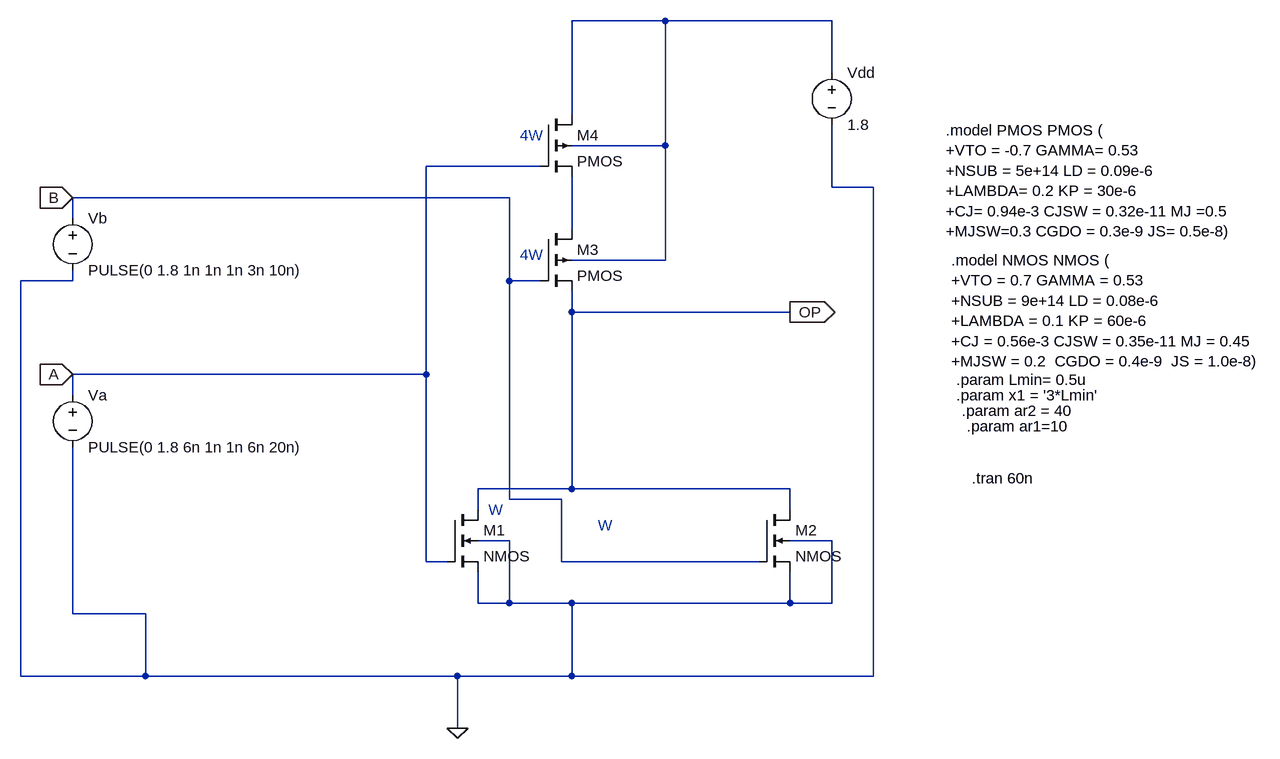
[diagram p0: schematic NOR.asc]
NOR.asc, the LTspice schematic file:
Version 4
SHEET 1 1364 680
WIRE 416 -464 272 -464
WIRE 672 -464 416 -464
WIRE 672 -384 672 -464
WIRE 272 -320 272 -464
WIRE 416 -272 416 -464
WIRE 416 -272 272 -272
WIRE 224 -240 48 -240
WIRE 672 -208 672 -304
WIRE 736 -208 672 -208
WIRE 176 -192 -496 -192
WIRE -496 -160 -496 -192
WIRE 272 -144 272 -224
WIRE 416 -96 416 -272
WIRE 416 -96 272 -96
WIRE -496 -64 -496 -80
WIRE -496 -64 -576 -64
WIRE 176 -64 176 -192
WIRE 224 -64 176 -64
WIRE 272 -16 272 -48
WIRE 608 -16 272 -16
WIRE 48 80 48 -240
WIRE 48 80 -496 80
WIRE -496 112 -496 80
WIRE 272 256 272 -16
WIRE 272 256 128 256
WIRE 608 256 272 256
WIRE 176 272 176 -64
WIRE 256 272 176 272
WIRE 128 288 128 256
WIRE 608 288 608 256
WIRE 176 336 128 336
WIRE 672 336 608 336
WIRE 48 368 48 80
WIRE 80 368 48 368
WIRE 256 368 256 272
WIRE 560 368 256 368
WIRE 128 432 128 384
WIRE 176 432 176 336
WIRE 176 432 128 432
WIRE 272 432 176 432
WIRE 608 432 608 384
WIRE 608 432 272 432
WIRE 672 432 672 336
WIRE 672 432 608 432
WIRE -496 448 -496 192
WIRE -384 448 -496 448
WIRE -576 544 -576 -64
WIRE -384 544 -384 448
WIRE -384 544 -576 544
WIRE 96 544 -384 544
WIRE 272 544 272 432
WIRE 272 544 96 544
WIRE 736 544 736 -208
WIRE 736 544 272 544
WIRE 96 624 96 544
FLAG 608 -16 OP
IOPIN 608 -16 Out
FLAG -496 -192 B
IOPIN -496 -192 In
FLAG -496 80 A
IOPIN -496 80 In
FLAG 96 624 0
SYMBOL nmos4 80 288 R0
SYMATTR InstName M1
SYMATTR Value2 l={Lmin} w={AR1*Lmin} ad={x1*AR1*Lmin} as={x1*AR1*Lmin} pd={2*x1 + 2*AR1*Lmin} ps={2*x1 + 2*AR1*Lmin}
SYMBOL nmos4 560 288 R0
SYMATTR InstName M2
SYMATTR Value2 l={Lmin} w={AR1*Lmin} ad={x1*AR1*Lmin} as={x1*AR1*Lmin} pd={2*x1 + 2*AR1*Lmin} ps={2*x1 + 2*AR1*Lmin}
SYMBOL pmos4 224 -144 R0
SYMATTR InstName M3
SYMATTR Value2 l={Lmin} w={AR2*Lmin} ad={x1*AR2*Lmin} as={x1*AR2*Lmin} pd={2*x1 + 2*AR2*Lmin} ps={2*x1 + 2*AR2*Lmin}
SYMBOL pmos4 224 -320 R0
SYMATTR InstName M4
SYMATTR Value2 l={Lmin} w={AR2*Lmin} ad={x1*AR2*Lmin} as={x1*AR2*Lmin} pd={2*x1 + 2*AR2*Lmin} ps={2*x1 + 2*AR2*Lmin}
SYMBOL voltage 672 -400 R0
SYMATTR InstName Vdd
SYMATTR Value 1.8
SYMBOL voltage -496 96 R0
WINDOW 123 0 0 Left 0
WINDOW 39 0 0 Left 0
SYMATTR InstName Va
SYMATTR Value PULSE(0 1.8 6n 1n 1n 6n 20n)
SYMBOL voltage -496 -176 R0
WINDOW 123 0 0 Left 0
WINDOW 39 0 0 Left 0
SYMATTR InstName Vb
SYMATTR Value PULSE(0 1.8 1n 1n 1n 3n 10n)
TEXT 848 -296 Left 2 !.model PMOS PMOS (\n+VTO = -0.7 GAMMA= 0.53 \n+NSUB = 5e+14 LD = 0.09e-6 \n+LAMBDA= 0.2 KP = 30e-6\n+CJ= 0.94e-3 CJSW = 0.32e-11 MJ =0.5 \n+MJSW=0.3 CGDO = 0.3e-9 JS= 0.5e-8)
TEXT 856 -96 Left 2 !.model NMOS NMOS ( \n+VTO = 0.7 GAMMA = 0.53 \n+NSUB = 9e+14 LD = 0.08e-6 \n+LAMBDA = 0.1 KP = 60e-6 \n+CJ = 0.56e-3 CJSW = 0.35e-11 MJ = 0.45 \n+MJSW = 0.2  CGDO = 0.4e-9  JS = 1.0e-8)
TEXT 864 88 Left 2 !.param Lmin= 0.5u
TEXT 864 112 Left 2 !.param x1 = '3*Lmin'
TEXT 872 136 Left 2 !.param ar2 = 40
TEXT 880 160 Left 2 !.param ar1=10
TEXT 888 240 Left 2 !.tran 60n
TEXT 144 288 Left 2 ;W
TEXT 312 312 Left 2 ;W
TEXT 192 -288 Left 2 ;4W
TEXT 192 -104 Left 2 ;4W

The netlist it stands for:
* NOR.asc
M1 OP A 0 0 NMOS l={Lmin} w={AR1*Lmin} ad={x1*AR1*Lmin} as={x1*AR1*Lmin} pd={2*x1 + 2*AR1*Lmin} ps={2*x1 + 2*AR1*Lmin}
M2 OP B 0 0 NMOS l={Lmin} w={AR1*Lmin} ad={x1*AR1*Lmin} as={x1*AR1*Lmin} pd={2*x1 + 2*AR1*Lmin} ps={2*x1 + 2*AR1*Lmin}
M3 N002 B OP N001 PMOS l={Lmin} w={AR2*Lmin} ad={x1*AR2*Lmin} as={x1*AR2*Lmin} pd={2*x1 + 2*AR2*Lmin} ps={2*x1 + 2*AR2*Lmin}
M4 N001 A N002 N001 PMOS l={Lmin} w={AR2*Lmin} ad={x1*AR2*Lmin} as={x1*AR2*Lmin} pd={2*x1 + 2*AR2*Lmin} ps={2*x1 + 2*AR2*Lmin}
Vdd N001 0 1.8
Va A 0 PULSE(0 1.8 6n 1n 1n 6n 20n)
Vb B 0 PULSE(0 1.8 1n 1n 1n 3n 10n)
.model NMOS NMOS
.model PMOS PMOS
.lib standard.mos
.model PMOS PMOS (
+VTO = -0.7 GAMMA= 0.53
+NSUB = 5e+14 LD = 0.09e-6
+LAMBDA= 0.2 KP = 30e-6
+CJ= 0.94e-3 CJSW = 0.32e-11 MJ =0.5
+MJSW=0.3 CGDO = 0.3e-9 JS= 0.5e-8)
.model NMOS NMOS (
+VTO = 0.7 GAMMA = 0.53
+NSUB = 9e+14 LD = 0.08e-6
+LAMBDA = 0.1 KP = 60e-6
+CJ = 0.56e-3 CJSW = 0.35e-11 MJ = 0.45
+MJSW = 0.2  CGDO = 0.4e-9  JS = 1.0e-8)
.param Lmin= 0.5u
.param x1 = '3*Lmin'
.param ar2 = 40
.param ar1=10
.tran 60n
* W
* W
* 4W
* 4W
.backanno
.end